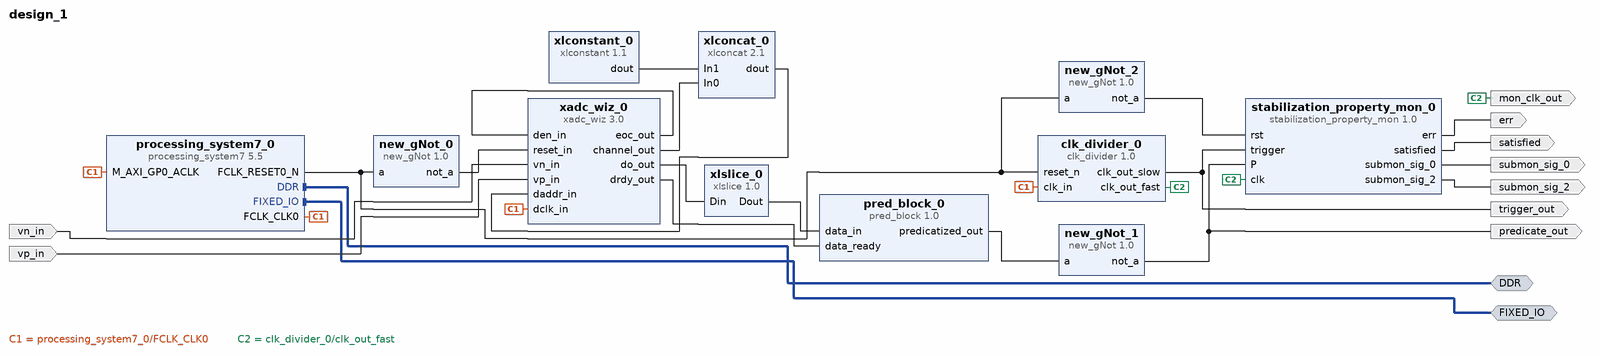
[diagram p0: block diagram of the top level]
# Vivado block design design_1, Vivado 2014.4
create_bd_design design_1

create_bd_intf_port -mode Master -vlnv xilinx.com:interface:ddrx_rtl:1.0 DDR
create_bd_intf_port -mode Master -vlnv xilinx.com:display_processing_system7:fixedio_rtl:1.0 FIXED_IO
create_bd_port -dir I vn_in
create_bd_port -dir I vp_in
create_bd_port -dir O err
create_bd_port -dir O satisfied
create_bd_port -dir O mon_clk_out
create_bd_port -dir O trigger_out
create_bd_port -dir O predicate_out
create_bd_port -dir O submon_sig_0
create_bd_port -dir O submon_sig_2

create_bd_cell -type ip -vlnv xilinx.com:ip:processing_system7:5.5 processing_system7_0
create_bd_cell -type ip -vlnv xilinx.com:ip:xadc_wiz:3.0 xadc_wiz_0
set_property -dict [list \
  CONFIG.INTERFACE_SELECTION ENABLE_DRP \
  CONFIG.SIM_FILE_SEL Default \
  CONFIG.WAVEFORM_TYPE SQUARE \
  CONFIG.TIMING_MODE Continuous \
  CONFIG.ENABLE_CALIBRATION_AVERAGING false \
  CONFIG.ENABLE_RESET true \
  CONFIG.OT_ALARM false \
  CONFIG.USER_TEMP_ALARM false \
  CONFIG.VCCINT_ALARM false \
  CONFIG.VCCAUX_ALARM false \
  CONFIG.ENABLE_VCCPINT_ALARM false \
  CONFIG.ENABLE_VCCPAUX_ALARM false \
  CONFIG.ENABLE_VCCDDRO_ALARM false \
  CONFIG.SINGLE_CHANNEL_SELECTION VP_VN \
  CONFIG.ACQUISITION_TIME 4 \
] [get_bd_cells xadc_wiz_0]
create_bd_cell -type ip -vlnv xilinx.com:ip:xlconcat:2.1 xlconcat_0
set_property -dict {CONFIG.IN0_WIDTH 5 CONFIG.IN1_WIDTH 2} [get_bd_cells xlconcat_0]
create_bd_cell -type ip -vlnv xilinx.com:ip:xlslice:1.0 xlslice_0
set_property -dict {CONFIG.DIN_TO 4 CONFIG.DIN_FROM 15 CONFIG.DIN_WIDTH 16} [get_bd_cells xlslice_0]
create_bd_cell -type ip -vlnv xilinx.com:ip:xlconstant:1.1 xlconstant_0
set_property -dict {CONFIG.CONST_WIDTH 2 CONFIG.CONST_VAL 00} [get_bd_cells xlconstant_0]
create_bd_cell -type ip -vlnv arc.local:user:new_gNot:1.0 new_gNot_0
create_bd_cell -type ip -vlnv arc.local:user:pred_block:1.0 pred_block_0
set_property -dict {CONFIG.THRESHOLD 2048} [get_bd_cells pred_block_0]
create_bd_cell -type ip -vlnv arc.local:user:new_gNot:1.0 new_gNot_1
create_bd_cell -type ip -vlnv arc.local:user:new_gNot:1.0 new_gNot_2
create_bd_cell -type ip -vlnv arc.local:user:clk_divider:1.0 clk_divider_0
create_bd_cell -type ip -vlnv arc.local:user:stabilization_property_mon:1.0 stabilization_property_mon_0
set_property -dict {CONFIG.DIV_TIME 200 CONFIG.STAB_TIME 100} [get_bd_cells stabilization_property_mon_0]

# ---- connections ----

connect_bd_intf_net [get_bd_intf_ports DDR] [get_bd_intf_pins processing_system7_0/DDR]
connect_bd_intf_net [get_bd_intf_ports FIXED_IO] [get_bd_intf_pins processing_system7_0/FIXED_IO]
connect_bd_net [get_bd_ports vn_in] [get_bd_pins xadc_wiz_0/vn_in]
connect_bd_net [get_bd_ports vp_in] [get_bd_pins xadc_wiz_0/vp_in]
connect_bd_net [get_bd_pins xadc_wiz_0/eoc_out] [get_bd_pins xadc_wiz_0/den_in]
connect_bd_net [get_bd_pins xlconcat_0/dout] [get_bd_pins xadc_wiz_0/daddr_in]
connect_bd_net [get_bd_pins xadc_wiz_0/do_out] [get_bd_pins xlslice_0/Din]
connect_bd_net -net Dout [get_bd_pins xlslice_0/Dout] [get_bd_pins pred_block_0/data_in]
connect_bd_net [get_bd_pins xlconstant_0/dout] [get_bd_pins xlconcat_0/In1]
connect_bd_net [get_bd_pins xadc_wiz_0/channel_out] [get_bd_pins xlconcat_0/In0]
connect_bd_net -net drdy_out [get_bd_pins xadc_wiz_0/drdy_out] [get_bd_pins pred_block_0/data_ready]
connect_bd_net [get_bd_pins pred_block_0/predicatized_out] [get_bd_pins new_gNot_1/a]
connect_bd_net [get_bd_pins processing_system7_0/FCLK_CLK0] \
  [get_bd_pins processing_system7_0/M_AXI_GP0_ACLK] [get_bd_pins xadc_wiz_0/dclk_in] [get_bd_pins clk_divider_0/clk_in]
connect_bd_net -net mon_err_out [get_bd_pins stabilization_property_mon_0/err] [get_bd_ports err]
connect_bd_net -net mon_sat_out [get_bd_pins stabilization_property_mon_0/satisfied] [get_bd_ports satisfied]
connect_bd_net -net mon_clk_in [get_bd_pins clk_divider_0/clk_out_fast] [get_bd_ports mon_clk_out] [get_bd_pins stabilization_property_mon_0/clk]
connect_bd_net -net mon_trig_in [get_bd_pins clk_divider_0/clk_out_slow] [get_bd_ports trigger_out] [get_bd_pins stabilization_property_mon_0/trigger]
connect_bd_net -net mon_pred_in [get_bd_pins new_gNot_1/not_a] [get_bd_ports predicate_out] [get_bd_pins stabilization_property_mon_0/P]
connect_bd_net -net mon_rst_in [get_bd_pins new_gNot_2/not_a] [get_bd_pins stabilization_property_mon_0/rst]
connect_bd_net [get_bd_pins processing_system7_0/FCLK_RESET0_N] \
  [get_bd_pins new_gNot_0/a] [get_bd_pins new_gNot_2/a] [get_bd_pins clk_divider_0/reset_n]
connect_bd_net [get_bd_pins new_gNot_0/not_a] [get_bd_pins xadc_wiz_0/reset_in]
connect_bd_net -net submon_sig_2 [get_bd_pins stabilization_property_mon_0/submon_sig_2] [get_bd_ports submon_sig_2]
connect_bd_net -net submon_sig_0 [get_bd_pins stabilization_property_mon_0/submon_sig_0] [get_bd_ports submon_sig_0]

validate_bd_design
save_bd_design
